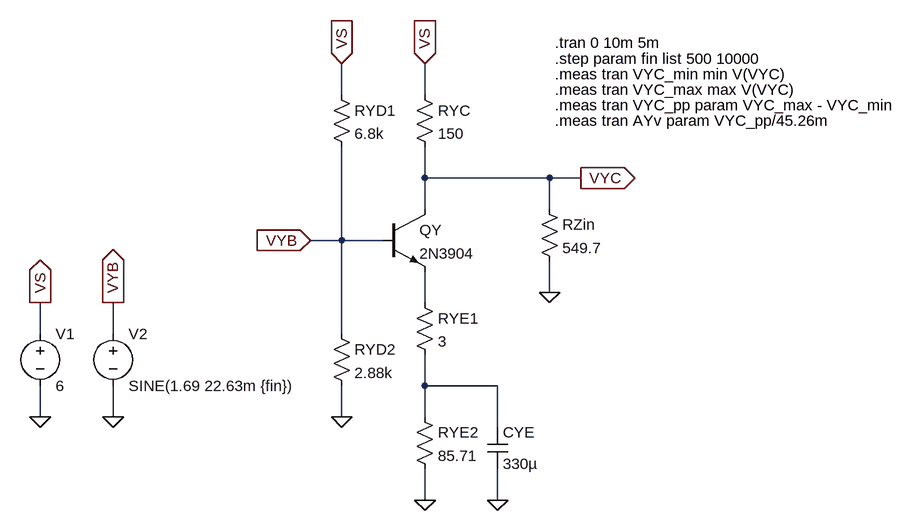
[diagram p0: schematic y.asc]
y.asc, the LTspice schematic file:
Version 4.1
SHEET 1 976 680
WIRE 96 -112 96 -160
WIRE 224 -112 224 -160
WIRE 224 16 224 -32
WIRE 416 16 224 16
WIRE 464 16 416 16
WIRE 224 64 224 16
WIRE 416 64 416 16
WIRE 96 112 96 -32
WIRE 96 112 48 112
WIRE 160 112 96 112
WIRE 416 192 416 144
WIRE 224 208 224 160
WIRE -368 256 -368 208
WIRE -256 256 -256 208
WIRE 96 256 96 112
WIRE 224 336 224 288
WIRE 336 336 224 336
WIRE -368 384 -368 336
WIRE -256 384 -256 336
WIRE 96 384 96 336
WIRE 224 384 224 336
WIRE 336 400 336 336
WIRE 224 512 224 464
WIRE 336 512 336 464
FLAG 224 512 0
FLAG 336 512 0
FLAG 464 16 VYC
IOPIN 464 16 Out
FLAG 96 384 0
FLAG 48 112 VYB
IOPIN 48 112 In
FLAG 96 -160 VS
IOPIN 96 -160 In
FLAG 224 -160 VS
IOPIN 224 -160 In
FLAG -256 384 0
FLAG -368 384 0
FLAG -368 208 VS
IOPIN -368 208 Out
FLAG -256 208 VYB
IOPIN -256 208 Out
FLAG 416 192 0
SYMBOL npn 160 64 R0
SYMATTR InstName QY
SYMATTR Value 2N3904
SYMBOL res 208 368 R0
SYMATTR InstName RYE2
SYMATTR Value 85.71
SYMBOL cap 320 400 R0
SYMATTR InstName CYE
SYMATTR Value 330µ
SYMBOL res 208 -128 R0
SYMATTR InstName RYC
SYMATTR Value 150
SYMBOL res 80 -128 R0
SYMATTR InstName RYD1
SYMATTR Value 6.8k
SYMBOL res 80 240 R0
SYMATTR InstName RYD2
SYMATTR Value 2.88k
SYMBOL voltage -256 240 R0
WINDOW 123 0 0 Left 0
WINDOW 39 0 0 Left 0
SYMATTR InstName V2
SYMATTR Value SINE(1.69 22.63m {fin})
SYMBOL voltage -368 240 R0
SYMATTR InstName V1
SYMATTR Value 6
SYMBOL res 208 192 R0
SYMATTR InstName RYE1
SYMATTR Value 3
SYMBOL res 400 48 R0
SYMATTR InstName RZin
SYMATTR Value 549.7
TEXT 424 -192 Left 2 !.tran 0 10m 5m
TEXT 424 -168 Left 2 !.step param fin list 500 10000
TEXT 424 -144 Left 2 !.meas tran VYC_min min V(VYC)
TEXT 424 -120 Left 2 !.meas tran VYC_max max V(VYC)
TEXT 424 -96 Left 2 !.meas tran VYC_pp param VYC_max - VYC_min
TEXT 424 -72 Left 2 !.meas tran AYv param VYC_pp/45.26m

The netlist it stands for:
* y.asc
QY VYC VYB N001 0 2N3904
RYE2 N002 0 85.71
CYE N002 0 330µ
RYC VS VYC 150
RYD1 VS VYB 6.8k
RYD2 VYB 0 2.88k
V2 VYB 0 SINE(1.69 22.63m {fin})
V1 VS 0 6
RYE1 N001 N002 3
RZin VYC 0 549.7
.model NPN NPN
.model PNP PNP
.lib standard.bjt
.tran 0 10m 5m
.step param fin list 500 10000
.meas tran VYC_min min V(VYC)
.meas tran VYC_max max V(VYC)
.meas tran VYC_pp param VYC_max - VYC_min
.meas tran AYv param VYC_pp/45.26m
.backanno
.end